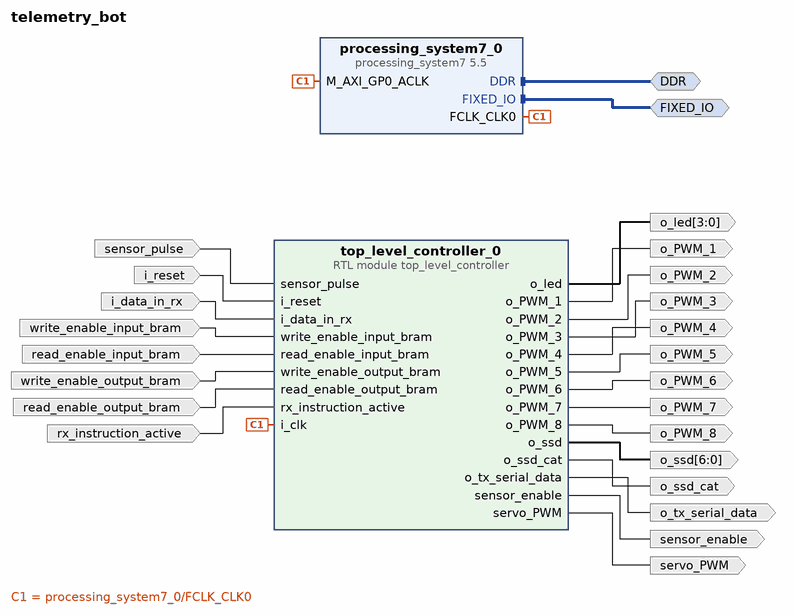
[diagram p0: block diagram of the top level]
# Vivado block design telemetry_bot, xc7z020clg400-1, Vivado 2020.2
create_bd_design telemetry_bot

create_bd_intf_port -mode Master -vlnv xilinx.com:interface:ddrx_rtl:1.0 DDR
create_bd_intf_port -mode Master -vlnv xilinx.com:display_processing_system7:fixedio_rtl:1.0 FIXED_IO
create_bd_port -dir I sensor_pulse
create_bd_port -dir I -type rst i_reset
create_bd_port -dir I i_data_in_rx
create_bd_port -dir I write_enable_input_bram
create_bd_port -dir I read_enable_input_bram
create_bd_port -dir I write_enable_output_bram
create_bd_port -dir I read_enable_output_bram
create_bd_port -dir I rx_instruction_active
create_bd_port -dir O sensor_enable
create_bd_port -dir O o_tx_serial_data
create_bd_port -dir O o_PWM_1
create_bd_port -dir O o_PWM_2
create_bd_port -dir O o_PWM_3
create_bd_port -dir O o_PWM_4
create_bd_port -dir O o_PWM_5
create_bd_port -dir O o_PWM_6
create_bd_port -dir O o_PWM_7
create_bd_port -dir O o_PWM_8
create_bd_port -dir O servo_PWM
create_bd_port -dir O -from 6 -to 0 o_ssd
create_bd_port -dir O o_ssd_cat
create_bd_port -dir O -from 3 -to 0 o_led

create_bd_cell -type ip -vlnv xilinx.com:ip:processing_system7:5.5 processing_system7_0
set_property -dict [list \
  CONFIG.PCW_APU_PERIPHERAL_FREQMHZ 667 \
  CONFIG.PCW_ENET0_PERIPHERAL_ENABLE 0 \
  CONFIG.PCW_ENET0_RESET_ENABLE 0 \
  CONFIG.PCW_ENET_RESET_ENABLE 1 \
  CONFIG.PCW_FPGA0_PERIPHERAL_FREQMHZ 125 \
  CONFIG.PCW_GPIO_MIO_GPIO_ENABLE 1 \
  CONFIG.PCW_GPIO_MIO_GPIO_IO MIO \
  CONFIG.PCW_I2C_RESET_ENABLE 1 \
  CONFIG.PCW_PRESET_BANK1_VOLTAGE {LVCMOS 1.8V} \
  CONFIG.PCW_QSPI_GRP_FBCLK_ENABLE 1 \
  CONFIG.PCW_QSPI_GRP_FBCLK_IO {MIO 8} \
  CONFIG.PCW_QSPI_GRP_SINGLE_SS_ENABLE 1 \
  CONFIG.PCW_QSPI_GRP_SINGLE_SS_IO {MIO 1 .. 6} \
  CONFIG.PCW_QSPI_PERIPHERAL_ENABLE 1 \
  CONFIG.PCW_QSPI_QSPI_IO {MIO 1 .. 6} \
  CONFIG.PCW_SD0_PERIPHERAL_ENABLE 0 \
  CONFIG.PCW_SDIO_PERIPHERAL_FREQMHZ 50 \
  CONFIG.PCW_SINGLE_QSPI_DATA_MODE x4 \
  CONFIG.PCW_UART1_PERIPHERAL_ENABLE 1 \
  CONFIG.PCW_UART1_UART1_IO {MIO 48 .. 49} \
  CONFIG.PCW_UART_PERIPHERAL_FREQMHZ 100 \
  CONFIG.PCW_UIPARAM_DDR_FREQ_MHZ 533.333333 \
  CONFIG.PCW_UIPARAM_DDR_MEMORY_TYPE {DDR 3 (Low Voltage)} \
  CONFIG.PCW_UIPARAM_DDR_PARTNO {MT41K256M16 RE-125} \
  CONFIG.PCW_USB0_PERIPHERAL_ENABLE 0 \
  CONFIG.PCW_USB0_RESET_ENABLE 1 \
  CONFIG.PCW_USB0_RESET_IO {MIO 46} \
  CONFIG.PCW_USB_RESET_ENABLE 1 \
] [get_bd_cells processing_system7_0]
# 293 more settings of processing_system7_0 are not shown: defaults, MIO pin electricals, DDR timing, and values the tool derives
create_bd_cell -type module -reference top_level_controller top_level_controller_0

# ---- connections ----

connect_bd_intf_net [get_bd_intf_ports FIXED_IO] [get_bd_intf_pins processing_system7_0/FIXED_IO]
connect_bd_intf_net [get_bd_intf_ports DDR] [get_bd_intf_pins processing_system7_0/DDR]
connect_bd_net [get_bd_pins processing_system7_0/FCLK_CLK0] \
  [get_bd_pins processing_system7_0/M_AXI_GP0_ACLK] [get_bd_pins top_level_controller_0/i_clk]
connect_bd_net -net sensor_pulse_0_1 [get_bd_ports sensor_pulse] [get_bd_pins top_level_controller_0/sensor_pulse]
connect_bd_net -net i_reset_0_1 [get_bd_ports i_reset] [get_bd_pins top_level_controller_0/i_reset]
connect_bd_net -net i_data_in_rx_0_1 [get_bd_ports i_data_in_rx] [get_bd_pins top_level_controller_0/i_data_in_rx]
connect_bd_net -net write_enable_input_bram_0_1 [get_bd_ports write_enable_input_bram] [get_bd_pins top_level_controller_0/write_enable_input_bram]
connect_bd_net -net read_enable_input_bram_0_1 [get_bd_ports read_enable_input_bram] [get_bd_pins top_level_controller_0/read_enable_input_bram]
connect_bd_net -net write_enable_output_bram_0_1 [get_bd_ports write_enable_output_bram] [get_bd_pins top_level_controller_0/write_enable_output_bram]
connect_bd_net -net read_enable_output_bram_0_1 [get_bd_ports read_enable_output_bram] [get_bd_pins top_level_controller_0/read_enable_output_bram]
connect_bd_net -net rx_instruction_active_0_1 [get_bd_ports rx_instruction_active] [get_bd_pins top_level_controller_0/rx_instruction_active]
connect_bd_net [get_bd_pins top_level_controller_0/sensor_enable] [get_bd_ports sensor_enable]
connect_bd_net [get_bd_pins top_level_controller_0/o_tx_serial_data] [get_bd_ports o_tx_serial_data]
connect_bd_net [get_bd_pins top_level_controller_0/o_PWM_1] [get_bd_ports o_PWM_1]
connect_bd_net [get_bd_pins top_level_controller_0/o_PWM_2] [get_bd_ports o_PWM_2]
connect_bd_net [get_bd_pins top_level_controller_0/o_PWM_3] [get_bd_ports o_PWM_3]
connect_bd_net [get_bd_pins top_level_controller_0/o_PWM_4] [get_bd_ports o_PWM_4]
connect_bd_net [get_bd_pins top_level_controller_0/o_PWM_5] [get_bd_ports o_PWM_5]
connect_bd_net [get_bd_pins top_level_controller_0/o_PWM_6] [get_bd_ports o_PWM_6]
connect_bd_net [get_bd_pins top_level_controller_0/o_PWM_7] [get_bd_ports o_PWM_7]
connect_bd_net [get_bd_pins top_level_controller_0/o_PWM_8] [get_bd_ports o_PWM_8]
connect_bd_net [get_bd_pins top_level_controller_0/servo_PWM] [get_bd_ports servo_PWM]
connect_bd_net [get_bd_pins top_level_controller_0/o_ssd] [get_bd_ports o_ssd]
connect_bd_net [get_bd_pins top_level_controller_0/o_ssd_cat] [get_bd_ports o_ssd_cat]
connect_bd_net [get_bd_pins top_level_controller_0/o_led] [get_bd_ports o_led]

validate_bd_design
save_bd_design
